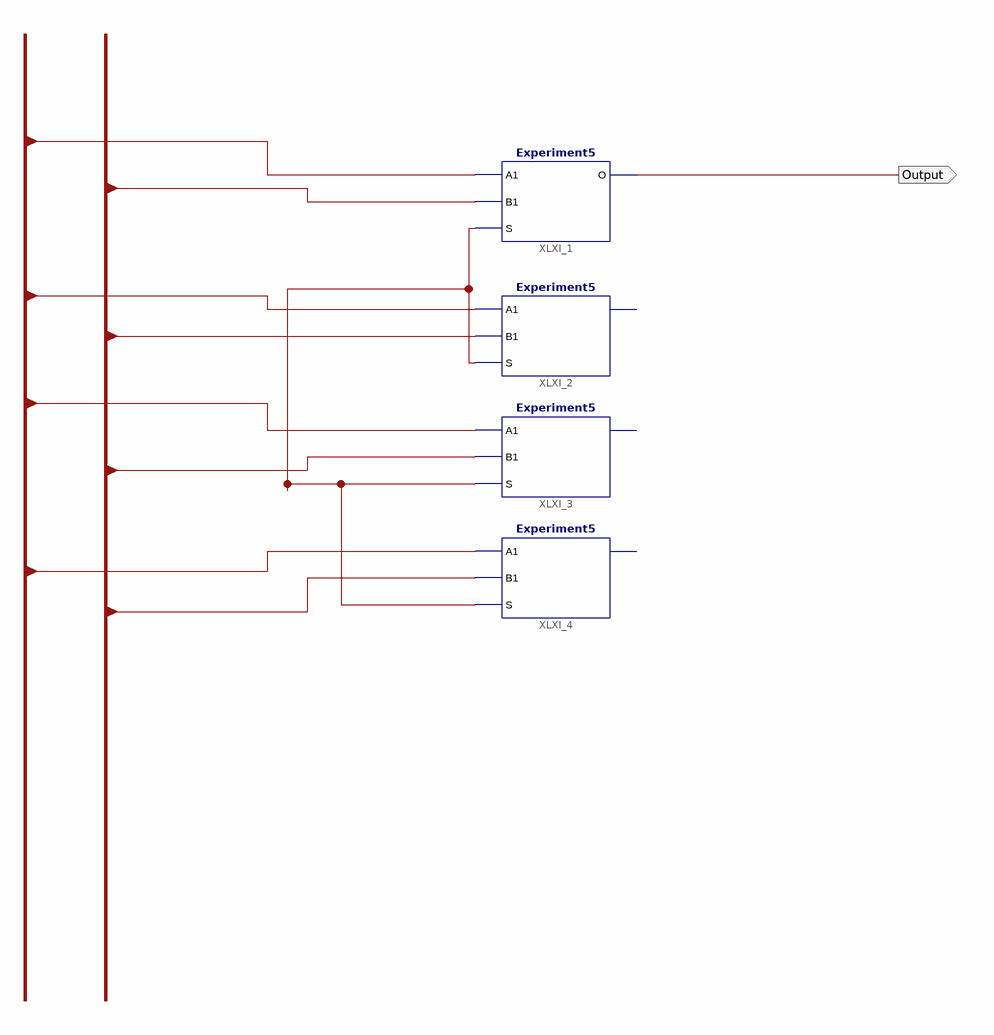
[diagram p0: schematic sheet 1]
// Xilinx ISE schematic Experiment55.sch (spartan3e) as structural Verilog: 4 symbols, 1 ports
module Experiment55 (
  output Output
);

  wire A1, XLXN_4, XLXN_12, XLXN_13, XLXN_14, XLXN_15, XLXN_16, XLXN_17, XLXN_18;

  Experiment5 XLXI_1 (.A1(A1), .B1(XLXN_18), .S(XLXN_4), .O(Output));
  Experiment5 XLXI_2 (.A1(XLXN_12), .B1(XLXN_17), .S(XLXN_4));  // open: O
  Experiment5 XLXI_3 (.A1(XLXN_13), .B1(XLXN_16), .S(XLXN_4));  // open: O
  Experiment5 XLXI_4 (.A1(XLXN_14), .B1(XLXN_15), .S(XLXN_4));  // open: O
endmodule
